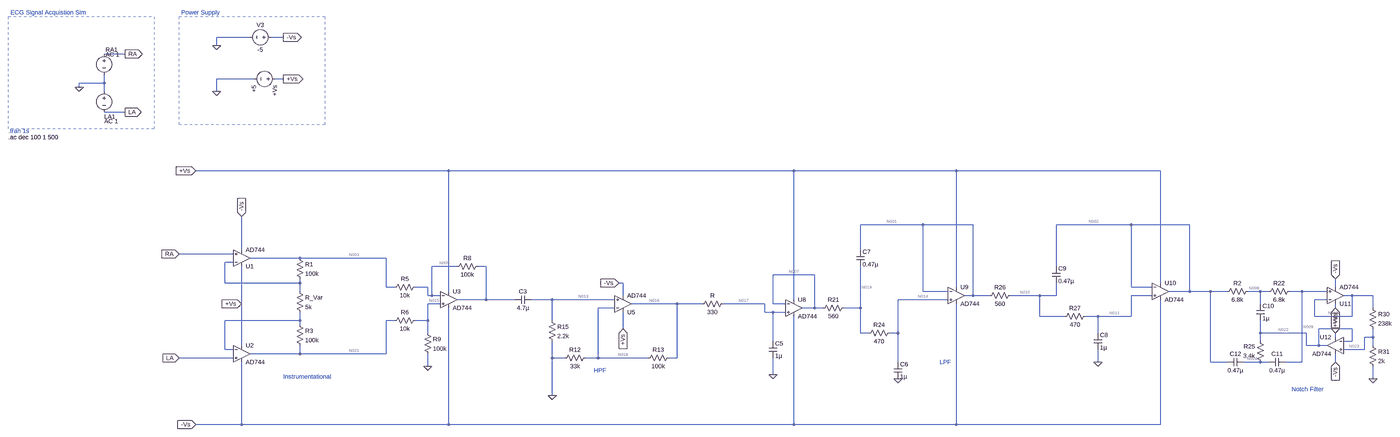
[diagram p0: schematic EMG.asc, whole sheet]
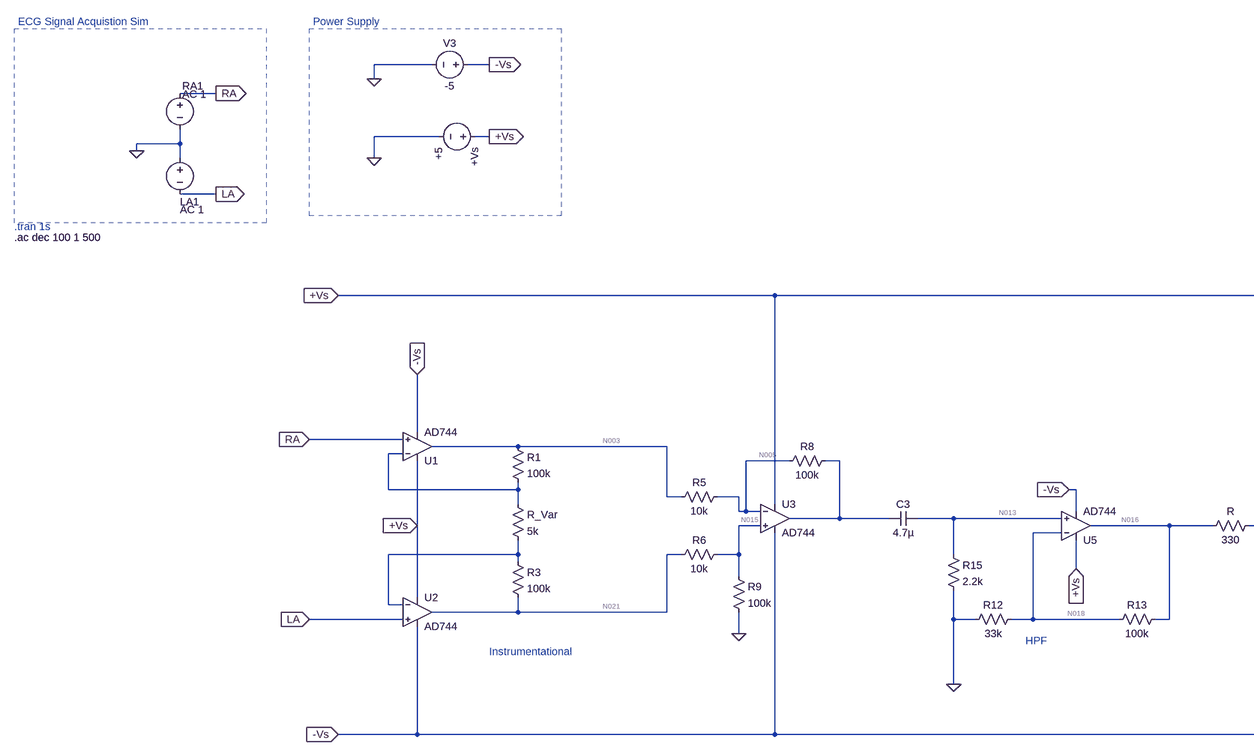
[diagram p1: schematic EMG.asc, part, row 1 of 1, column 1 of 2]
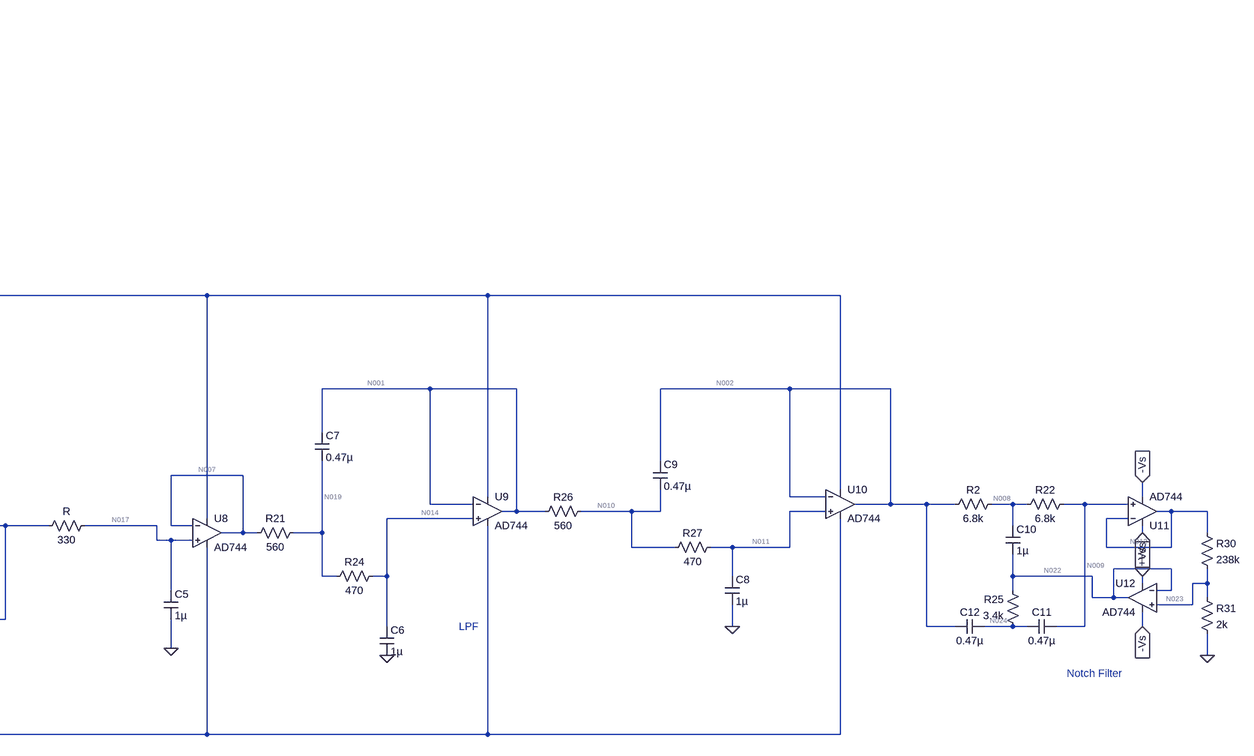
[diagram p2: schematic EMG.asc, part, row 1 of 1, column 2 of 2]
EMG.asc, the LTspice schematic file:
Version 4
SHEET 1 4836 1140
WIRE -96 -1024 -224 -1024
WIRE 32 -1024 -16 -1024
WIRE -224 -992 -224 -1024
WIRE -576 -960 -656 -960
WIRE -80 -864 -224 -864
WIRE 32 -864 0 -864
WIRE -656 -848 -656 -880
WIRE -656 -848 -752 -848
WIRE -752 -832 -752 -848
WIRE -656 -816 -656 -848
WIRE -224 -816 -224 -864
WIRE -576 -736 -656 -736
WIRE 752 -224 -304 -224
WIRE 2096 -224 752 -224
WIRE 2720 -224 2096 -224
WIRE 3504 -224 2720 -224
WIRE 2592 -16 2352 -16
WIRE 2784 -16 2592 -16
WIRE 3392 -16 3104 -16
WIRE 3616 -16 3392 -16
WIRE -128 80 -128 -48
WIRE 2352 80 2352 -16
WIRE -160 96 -368 96
WIRE 96 112 -96 112
WIRE 512 112 96 112
WIRE -160 128 -192 128
WIRE 784 144 688 144
WIRE 896 144 864 144
WIRE 3104 144 3104 -16
WIRE 2176 176 2016 176
WIRE -192 208 -192 128
WIRE 96 208 96 192
WIRE 96 208 -192 208
WIRE 1440 208 1424 208
WIRE 3504 208 3504 -224
WIRE 512 224 512 112
WIRE 544 224 512 224
WIRE 672 224 624 224
WIRE 2720 224 2720 -224
WIRE 3392 224 3392 -16
WIRE 3472 224 3392 224
WIRE 4176 224 4176 192
WIRE 96 240 96 208
WIRE 752 240 752 -224
WIRE 2592 240 2592 -16
WIRE 2688 240 2592 240
WIRE 3616 240 3616 -16
WIRE 3616 240 3536 240
WIRE 3696 240 3616 240
WIRE 3760 240 3696 240
WIRE 3888 240 3840 240
WIRE 3920 240 3888 240
WIRE 4048 240 4000 240
WIRE 4144 240 4048 240
WIRE 672 256 672 224
WIRE 688 256 688 144
WIRE 688 256 672 256
WIRE 720 256 688 256
WIRE 1440 256 1440 208
WIRE 2784 256 2784 -16
WIRE 2784 256 2752 256
WIRE 2848 256 2784 256
WIRE 3040 256 2928 256
WIRE 3104 256 3104 208
WIRE 3104 256 3040 256
WIRE 3472 256 3392 256
WIRE 4240 256 4208 256
WIRE 4320 256 4240 256
WIRE 896 272 896 144
WIRE 896 272 784 272
WIRE 1024 272 896 272
WIRE 1168 272 1088 272
WIRE 1408 272 1168 272
WIRE 2096 272 2096 -224
WIRE 2688 272 2496 272
WIRE 4144 272 4096 272
WIRE -128 288 -128 144
WIRE 720 288 672 288
WIRE 1648 288 1472 288
WIRE 1744 288 1648 288
WIRE 1984 288 1824 288
WIRE 2016 288 2016 176
WIRE 2064 288 2016 288
WIRE 3888 288 3888 240
WIRE 1408 304 1344 304
WIRE 2176 304 2176 176
WIRE 2176 304 2128 304
WIRE 2208 304 2176 304
WIRE 2352 304 2352 144
WIRE 2352 304 2288 304
WIRE 4176 304 4176 288
WIRE 4320 304 4320 256
WIRE 1984 320 1984 288
WIRE 2016 320 1984 320
WIRE 2064 320 2016 320
WIRE 3040 336 3040 256
WIRE 3136 336 3040 336
WIRE 3264 336 3216 336
WIRE 3392 336 3392 256
WIRE 3392 336 3264 336
WIRE 4096 336 4096 272
WIRE 4240 336 4240 256
WIRE 4240 336 4096 336
WIRE 96 352 96 320
WIRE 96 352 -192 352
WIRE 544 352 512 352
WIRE 672 352 672 288
WIRE 672 352 624 352
WIRE 1168 352 1168 272
WIRE 96 368 96 352
WIRE 1440 384 1440 320
WIRE 4240 384 4112 384
WIRE 672 400 672 352
WIRE 2352 400 2352 304
WIRE 2384 400 2352 400
WIRE 2496 400 2496 272
WIRE 2496 400 2464 400
WIRE 3264 400 3264 336
WIRE 3888 400 3888 352
WIRE 4064 400 3888 400
WIRE 4176 416 4176 400
WIRE 4320 416 4320 384
WIRE 4320 416 4288 416
WIRE 2016 432 2016 320
WIRE 3888 432 3888 400
WIRE 4240 432 4240 384
WIRE 4240 432 4208 432
WIRE -128 448 -128 288
WIRE 4064 448 4064 400
WIRE 4112 448 4112 384
WIRE 4112 448 4064 448
WIRE 4144 448 4112 448
WIRE 4320 448 4320 416
WIRE -192 464 -192 352
WIRE -160 464 -192 464
WIRE 4288 464 4288 416
WIRE 4288 464 4208 464
WIRE 96 480 96 448
WIRE 96 480 -96 480
WIRE 512 480 512 352
WIRE 512 480 96 480
WIRE -160 496 -368 496
WIRE 1168 496 1168 432
WIRE 1216 496 1168 496
WIRE 1344 496 1344 304
WIRE 1344 496 1296 496
WIRE 1536 496 1344 496
WIRE 1648 496 1648 288
WIRE 1648 496 1616 496
WIRE 2496 512 2496 400
WIRE 3264 512 3264 464
WIRE 3696 512 3696 240
WIRE 3760 512 3696 512
WIRE 3888 512 3824 512
WIRE 3920 512 3888 512
WIRE 4048 512 4048 240
WIRE 4048 512 3984 512
WIRE 4176 512 4176 480
WIRE 672 528 672 480
WIRE 2016 560 2016 496
WIRE 4320 576 4320 528
WIRE 1168 640 1168 496
WIRE -128 752 -128 512
WIRE -128 752 -304 752
WIRE 752 752 752 304
WIRE 752 752 -128 752
WIRE 2096 752 2096 336
WIRE 2096 752 752 752
WIRE 2720 752 2720 288
WIRE 2720 752 2096 752
WIRE 3504 752 3504 272
WIRE 3504 752 2720 752
FLAG 672 528 0
FLAG -128 288 +Vs
IOPIN -128 288 In
FLAG 32 -864 +Vs
IOPIN 32 -864 Out
FLAG -224 -992 0
FLAG 32 -1024 -Vs
IOPIN 32 -1024 Out
FLAG 1168 640 0
FLAG 2016 560 0
FLAG 2496 576 0
FLAG 3264 512 0
FLAG -304 -224 +Vs
IOPIN -304 -224 In
FLAG -304 752 -Vs
IOPIN -304 752 In
FLAG -128 -48 -Vs
IOPIN -128 -48 In
FLAG -368 96 RA
IOPIN -368 96 In
FLAG -368 496 LA
IOPIN -368 496 In
FLAG 1424 208 -Vs
IOPIN 1424 208 In
FLAG 1440 384 +Vs
IOPIN 1440 384 In
FLAG -752 -832 0
FLAG -576 -736 LA
IOPIN -576 -736 Out
FLAG -576 -960 RA
IOPIN -576 -960 Out
FLAG -224 -816 0
FLAG 4176 192 -Vs
IOPIN 4176 192 In
FLAG 4176 304 +Vs
IOPIN 4176 304 In
FLAG 4176 512 -Vs
IOPIN 4176 512 In
FLAG 4176 400 +Vs
IOPIN 4176 400 In
FLAG 4320 576 0
SYMBOL OpAmps\\AD744 -128 176 M180
SYMATTR InstName U1
SYMBOL OpAmps\\AD744 -128 416 R0
SYMATTR InstName U2
SYMBOL OpAmps\\AD744 752 208 R0
SYMATTR InstName U3
SYMBOL res 80 96 R0
SYMATTR InstName R1
SYMATTR Value 100k
SYMATTR SpiceLine tol=1
SYMBOL res 80 224 R0
SYMATTR InstName R_Var
SYMATTR Value 5k
SYMBOL res 80 352 R0
SYMATTR InstName R3
SYMATTR Value 100k
SYMATTR SpiceLine tol=1
SYMBOL res 640 208 R90
WINDOW 0 0 56 VBottom 2
WINDOW 3 32 56 VTop 2
SYMATTR InstName R5
SYMATTR Value 10k
SYMBOL res 640 336 R90
WINDOW 0 0 56 VBottom 2
WINDOW 3 32 56 VTop 2
SYMATTR InstName R6
SYMATTR Value 10k
SYMATTR SpiceLine tol=1
SYMBOL res 880 128 R90
WINDOW 0 0 56 VBottom 2
WINDOW 3 32 56 VTop 2
SYMATTR InstName R8
SYMATTR Value 100k
SYMBOL res 656 384 R0
SYMATTR InstName R9
SYMATTR Value 100k
SYMBOL voltage 16 -864 R90
WINDOW 123 0 0 Left 0
WINDOW 39 0 0 Left 0
SYMATTR InstName +Vs
SYMATTR Value +5
SYMBOL voltage 0 -1024 R90
WINDOW 0 -32 56 VBottom 2
WINDOW 3 32 56 VTop 2
WINDOW 123 0 0 Left 0
WINDOW 39 0 0 Left 0
SYMATTR InstName V3
SYMATTR Value -5
SYMBOL OpAmps\\AD744 1440 352 M180
SYMATTR InstName U5
SYMBOL cap 1088 256 R90
WINDOW 0 0 32 VBottom 2
WINDOW 3 32 32 VTop 2
SYMATTR InstName C3
SYMATTR Value 4.7µ
SYMBOL res 1152 336 R0
SYMATTR InstName R15
SYMATTR Value 2.2k
SYMATTR SpiceLine tol=1
SYMBOL OpAmps\\AD744 2096 240 R0
SYMATTR InstName U8
SYMBOL OpAmps\\AD744 2720 192 R0
SYMATTR InstName U9
SYMBOL OpAmps\\AD744 3504 176 R0
SYMATTR InstName U10
SYMBOL res 1840 272 R90
WINDOW 0 0 56 VBottom 2
WINDOW 3 32 56 VTop 2
SYMATTR InstName R
SYMATTR Value 330
SYMBOL res 2480 384 R90
WINDOW 0 0 56 VBottom 2
WINDOW 3 32 56 VTop 2
SYMATTR InstName R24
SYMATTR Value 470
SYMBOL res 2944 240 R90
WINDOW 0 0 56 VBottom 2
WINDOW 3 32 56 VTop 2
SYMATTR InstName R26
SYMATTR Value 560
SYMBOL res 3232 320 R90
WINDOW 0 0 56 VBottom 2
WINDOW 3 32 56 VTop 2
SYMATTR InstName R27
SYMATTR Value 470
SYMBOL cap 2000 432 R0
SYMATTR InstName C5
SYMATTR Value 1µ
SYMBOL cap 2480 512 R0
SYMATTR InstName C6
SYMATTR Value 1µ
SYMBOL cap 2336 80 R0
SYMATTR InstName C7
SYMATTR Value 0.47µ
SYMBOL cap 3248 400 R0
SYMATTR InstName C8
SYMATTR Value 1µ
SYMBOL cap 3088 144 R0
SYMATTR InstName C9
SYMATTR Value 0.47µ
SYMBOL res 2304 288 R90
WINDOW 0 0 56 VBottom 2
WINDOW 3 32 56 VTop 2
SYMATTR InstName R21
SYMATTR Value 560
SYMBOL voltage -656 -976 R0
WINDOW 0 5 0 Left 2
WINDOW 3 -337 54 Left 2
WINDOW 123 5 18 Left 2
WINDOW 39 0 0 Left 0
SYMATTR InstName RA1
SYMATTR Value ""
SYMATTR Value2 AC 1
SYMBOL voltage -656 -832 R0
WINDOW 0 0 113 Left 2
WINDOW 3 -337 54 Left 2
WINDOW 123 0 131 Left 2
WINDOW 39 0 0 Left 0
SYMATTR InstName LA1
SYMATTR Value ""
SYMATTR Value2 AC 1
SYMBOL OpAmps\\AD744 4176 320 M180
SYMATTR InstName U11
SYMBOL res 3856 224 R90
WINDOW 0 0 56 VBottom 2
WINDOW 3 32 56 VTop 2
SYMATTR InstName R2
SYMATTR Value 6.8k
SYMBOL res 4016 224 R90
WINDOW 0 0 56 VBottom 2
WINDOW 3 32 56 VTop 2
SYMATTR InstName R22
SYMATTR Value 6.8k
SYMBOL res 3904 528 R180
WINDOW 0 36 76 Left 2
WINDOW 3 36 40 Left 2
SYMATTR InstName R25
SYMATTR Value 3.4k
SYMBOL cap 3872 288 R0
SYMATTR InstName C10
SYMATTR Value 1µ
SYMBOL cap 3984 496 R90
WINDOW 0 0 32 VBottom 2
WINDOW 3 32 32 VTop 2
SYMATTR InstName C11
SYMATTR Value 0.47µ
SYMBOL cap 3824 496 R90
WINDOW 0 0 32 VBottom 2
WINDOW 3 32 32 VTop 2
SYMATTR InstName C12
SYMATTR Value 0.47µ
SYMBOL OpAmps\\AD744 4176 384 M0
SYMATTR InstName U12
SYMBOL res 4304 288 R0
SYMATTR InstName R30
SYMATTR Value 238k
SYMBOL res 4304 432 R0
SYMATTR InstName R31
SYMATTR Value 2k
SYMBOL res 1312 480 R90
WINDOW 0 0 56 VBottom 2
WINDOW 3 32 56 VTop 2
SYMATTR InstName R12
SYMATTR Value 33k
SYMBOL res 1632 480 R90
WINDOW 0 0 56 VBottom 2
WINDOW 3 32 56 VTop 2
SYMATTR InstName R13
SYMATTR Value 100k
TEXT 32 568 Left 2 ;Instrumentational
TEXT 1328 544 Left 2 ;HPF
TEXT 2656 512 Left 2 ;LPF
TEXT -1024 -664 Left 2 ;.tran 1s
TEXT -360 -1120 Left 2 ;Power Supply
TEXT -1016 -1120 Left 2 ;ECG Signal Acquistion Sim
TEXT 4008 616 Left 2 ;Notch Filter
TEXT -1024 -640 Left 2 !.ac dec 100 1 500
RECTANGLE Normal -464 -672 -1024 -1104 2
RECTANGLE Normal 192 -688 -368 -1104 2

The netlist it stands for:
* EMG.asc
XU1 RA N004 +Vs -Vs N003 AD744  ; pins In+ In- V+ V- OUT
XU2 LA N020 +Vs -Vs N021 AD744  ; pins In+ In- V+ V- OUT
XU3 N015 N005 +Vs -Vs N006 AD744  ; pins In+ In- V+ V- OUT
R1 N003 N004 100k tol=1
R_Var N004 N020 5k
R3 N020 N021 100k tol=1
R5 N005 N003 10k
R6 N015 N021 10k tol=1
R8 N006 N005 100k
R9 N015 0 100k
V§+Vs +Vs 0 +5
V3 -Vs 0 -5
XU5 N013 N018 +Vs -Vs N016 AD744  ; pins In+ In- V+ V- OUT
C3 N013 N006 4.7µ
R15 N013 0 2.2k tol=1
XU8 N017 N007 +Vs -Vs N007 AD744  ; pins In+ In- V+ V- OUT
XU9 N014 N001 +Vs -Vs N001 AD744  ; pins In+ In- V+ V- OUT
XU10 N011 N002 +Vs -Vs N002 AD744  ; pins In+ In- V+ V- OUT
R N017 N016 330
R24 N014 N019 470
R26 N010 N001 560
R27 N011 N010 470
C5 N017 0 1µ
C6 N014 0 1µ
C7 N001 N019 0.47µ
C8 N011 0 1µ
C9 N002 N010 0.47µ
R21 N019 N007 560
V§RA1 RA 0 AC 1
V§LA1 0 LA AC 1
XU11 N009 N012 +Vs -Vs N012 AD744  ; pins In+ In- V+ V- OUT
R2 N008 N002 6.8k
R22 N009 N008 6.8k
R25 N024 N022 3.4k
C10 N008 N022 1µ
C11 N009 N024 0.47µ
C12 N024 N002 0.47µ
XU12 N023 N022 +Vs -Vs N022 AD744  ; pins In+ In- V+ V- OUT
R30 N012 N023 238k
R31 N023 0 2k
R12 N018 0 33k
R13 N016 N018 100k
* Instrumentational
* HPF
* LPF
* .tran 1s
* Power Supply
* ECG Signal Acquistion Sim
* Notch Filter
.ac dec 100 1 500
.backanno
.end

* Results of the author's LTspice run, read from the files saved beside the schematic
* Operating Point, zero values left out:
*   V(+vs) = 5 V
*   V(n003) = 11 µV
*   V(-vs) = -5 V
*   V(n021) = 11 µV
*   V(n005) = 9 µV
*   V(n015) = 9 µV
*   V(n018) = -242 nV
*   V(n013) = -242 nV
*   V(n016) = 10.02 µV
*   V(n007) = 9.988 µV
*   V(n017) = 9.988 µV
*   V(n001) = 9.875 µV
*   V(n014) = 9.875 µV
*   V(n002) = 9.762 µV
*   V(n011) = 9.762 µV
*   V(n019) = 9.927 µV
*   V(n010) = 9.813 µV
*   V(n012) = 8.266 µV
*   V(n009) = 8.266 µV
*   V(n008) = 9.014 µV
*   V(n024) = -149.3 nV
*   V(n022) = -149.3 nV
*   V(n023) = -149.3 nV
*   I(R1) = 110 pA
*   I(R3) = -110 pA
*   I(R5) = -200 pA
*   I(R6) = -200 pA
*   I(R8) = -90 pA
*   I(R9) = 90 pA
*   I(R15) = -110 pA
*   I(R) = -110 pA
*   I(R24) = -110 pA
*   I(R26) = -110 pA
*   I(R27) = -110 pA
*   I(R21) = -110 pA
*   I(R2) = -110 pA
*   I(R22) = -110 pA
*   I(R30) = 35.36 pA
*   I(R31) = -74.64 pA
*   I(R12) = -7.334 pA
*   I(R13) = 102.7 pA
*   I(+vs) = -30.07 mA
*   I(V3) = 30.07 mA
*   I(Ra1) = -110 pA
*   I(La1) = 110 pA
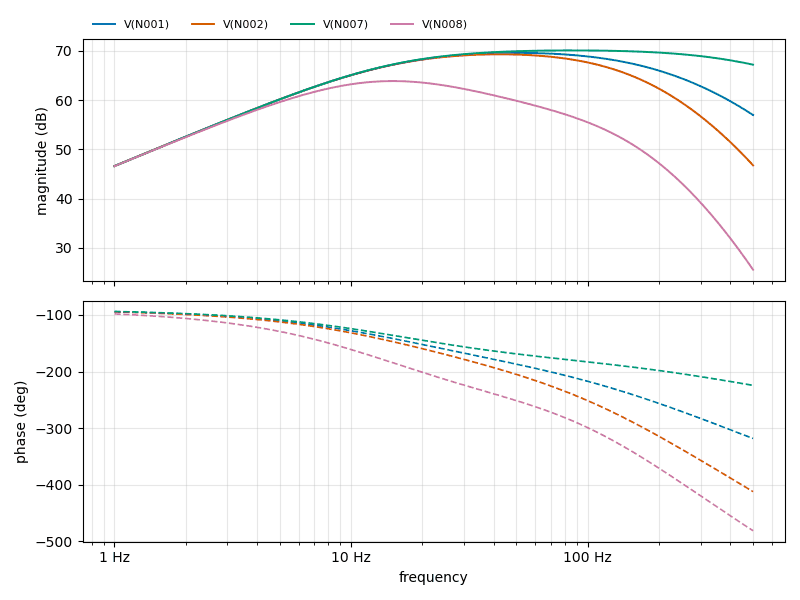
[diagram p3: AC Analysis of EMG.asc, plotted from the saved traces]
* AC Analysis, 1 run:
*   V(N001): 46.62 dB at 1 Hz, 56.99 dB at 500 Hz, peak 69.61 dB at 50.12 Hz, 3 dB below the peak at 13.12 Hz and 181.2 Hz
*   V(N002): 46.62 dB at 1 Hz, 46.77 dB at 500 Hz, peak 69.32 dB at 42.66 Hz, 3 dB below the peak at 12.46 Hz and 128.1 Hz
*   V(N007): 46.62 dB at 1 Hz, 67.21 dB at 500 Hz, peak 70.11 dB at 87.1 Hz, 3 dB below the peak at 14.49 Hz
*   V(N008): 46.59 dB at 1 Hz, 25.57 dB at 500 Hz, peak 63.88 dB at 15.14 Hz, 3 dB below the peak at 6.067 Hz and 41.06 Hz